# EAGLE design photon_v1.0.0 (EAGLE 7.2.0)

## Sheet 1 of 2
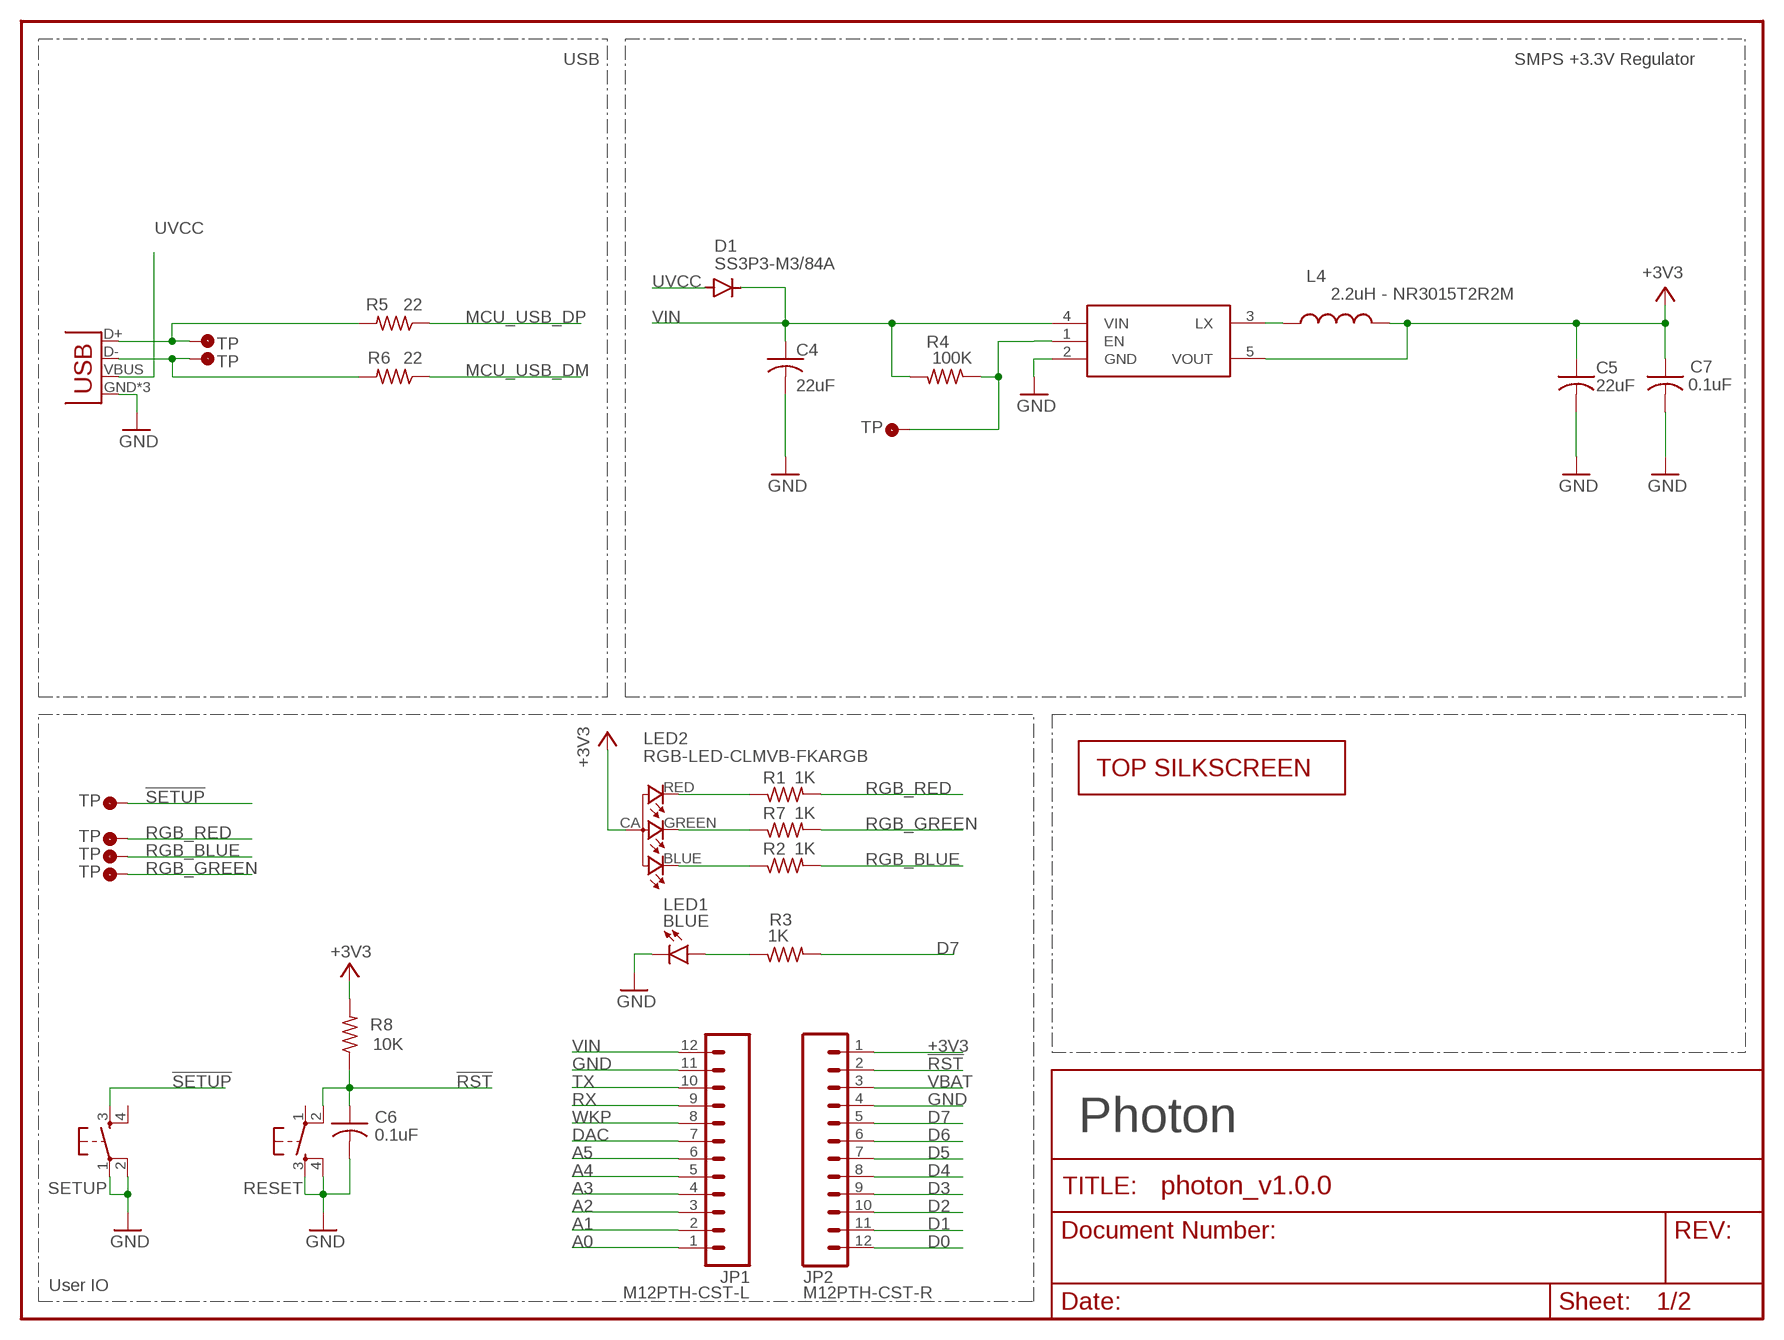
[diagram p0: schematic, sheet 1]

### Parts
C4  22uF  C-US0603  [C0603_B]
C5  22uF  C-US0603  [C0603_B]
C6  0.1uF  C-US  [C0402_B]
C7  0.1uF  C-US  [C0402_B]
D1  SS3P3-M3/84A  DIODE  [DIODE-DO-220AA(SMP)]
JP1  M12PTH-CST-L  [1X12-CASTELLATED]
JP2  M12PTH-CST-R  [1X12-CASTELLATED]
L4  2.2uH - NR3015T2R2M  INDUCTORB  [INDUCTOR-NR3015]
LED2  RGB-LED-CLMVB-FKARGB  [PLCC4-2MM-RGB]
LED_USR  BLUE  LED-0603-NO-SS  [LED-0603-NO-SS]
R1  1K  R-US_  [R0402_B]
R2  1K  R-US_  [R0402_B]
R3  1K  R-US_  [R0402_B]
R4  100K  R-US_  [R0402_B]
R5  22  R-US_  [R0402_B]
R6  22  R-US_  [R0402_B]
R7  1K  R-US_  [R0402_B]
R8  10K  R-US_  [R0402_B]
RESET  KMR211GLFS  TAC_SWITCHSMD  [TACTILE_SWITCH_SMD]
SETUP  KMR211GLFS  TAC_SWITCHSMD  [TACTILE_SWITCH_SMD]
U$1  PHOTON-TOP-SS2  [PHOTON-TOP-SS-2]
U$3  TP3  [TP60_BOT]
U$5  TP1  [TP35_BOT]
U$6  TP1  [TP35_BOT]
U$7  TP1  [TP35_BOT]
U$11  R8008-33  [SOT23-5]
U$12  TP3  [TP60_BOT]
U$13  TP3  [TP60_BOT]
U$14  TP3  [TP60_BOT]
X1  USB-MICROB  USBUSB-MICROB-SLOT-HOLE  [USB-MICROB-SLOT-HOLE]

### Nets
!RST: C6.1 JP2.2 R8.1 RESET.2 ; also sheet 2
!SETUP: SETUP.3 U$3.P$1(TP) ; also sheet 2
+3V3: C5.1 C7.1 JP2.1 L4.2 LED2.CA R8.2 U$11.5(VOUT) ; also sheet 2
A0: JP1.1 ; also sheet 2
A1: JP1.2 ; also sheet 2
A2: JP1.3 ; also sheet 2
A3: JP1.4 ; also sheet 2
A4: JP1.5 ; also sheet 2
A5: JP1.6 ; also sheet 2
D0: JP2.12 ; also sheet 2
D1: JP2.11 ; also sheet 2
D2: JP2.10 ; also sheet 2
D3: JP2.9 ; also sheet 2
D4: JP2.8 ; also sheet 2
D5: JP2.7 ; also sheet 2
D6: JP2.6 ; also sheet 2
D7: JP2.5 R3.2 ; also sheet 2
DAC: JP1.7 ; also sheet 2
GND: C4.2 C5.2 C6.2 C7.2 JP1.11 JP2.4 LED_USR.C1(C) RESET.3 RESET.4 SETUP.1 SETUP.2 U$11.2(GND) X1.GND X1.MT1(GND) X1.MT2(GND) ; also sheet 2
LED1: LED_USR.A1(A) R3.1
MCU_USB_DM: R6.1 ; also sheet 2
MCU_USB_DP: R5.1 ; also sheet 2
N$1: R5.2 U$13.P$1(TP) X1.D+
N$3: L4.1 U$11.3(LX)
N$6: R6.2 U$14.P$1(TP) X1.D-
N$7 [vcc]: R4.1 U$11.1(EN) U$12.P$1(TP)
N$27: LED2.BLUE R2.1
N$29: LED2.GREEN R7.1
N$54: LED2.RED R1.1
RGB_BLUE: R2.2 U$6.P$1(TP) ; also sheet 2
RGB_GREEN [vcc]: R7.2 U$7.P$1(TP) ; also sheet 2
RGB_RED: R1.2 U$5.P$1(TP) ; also sheet 2
RX: JP1.9 ; also sheet 2
TX: JP1.10 ; also sheet 2
UVCC: D1.ANODE X1.VBUS
VBAT: JP2.3 ; also sheet 2
VIN [vcc]: C4.1 D1.CATHODE JP1.12 R4.2 U$11.4(VIN)
WKP: JP1.8 ; also sheet 2
Unconnected: RESET.1 SETUP.4

### Notes on the sheet
- USB | SMPS +3.3V Regulator
- Photon
- User IO

## Sheet 2 of 2
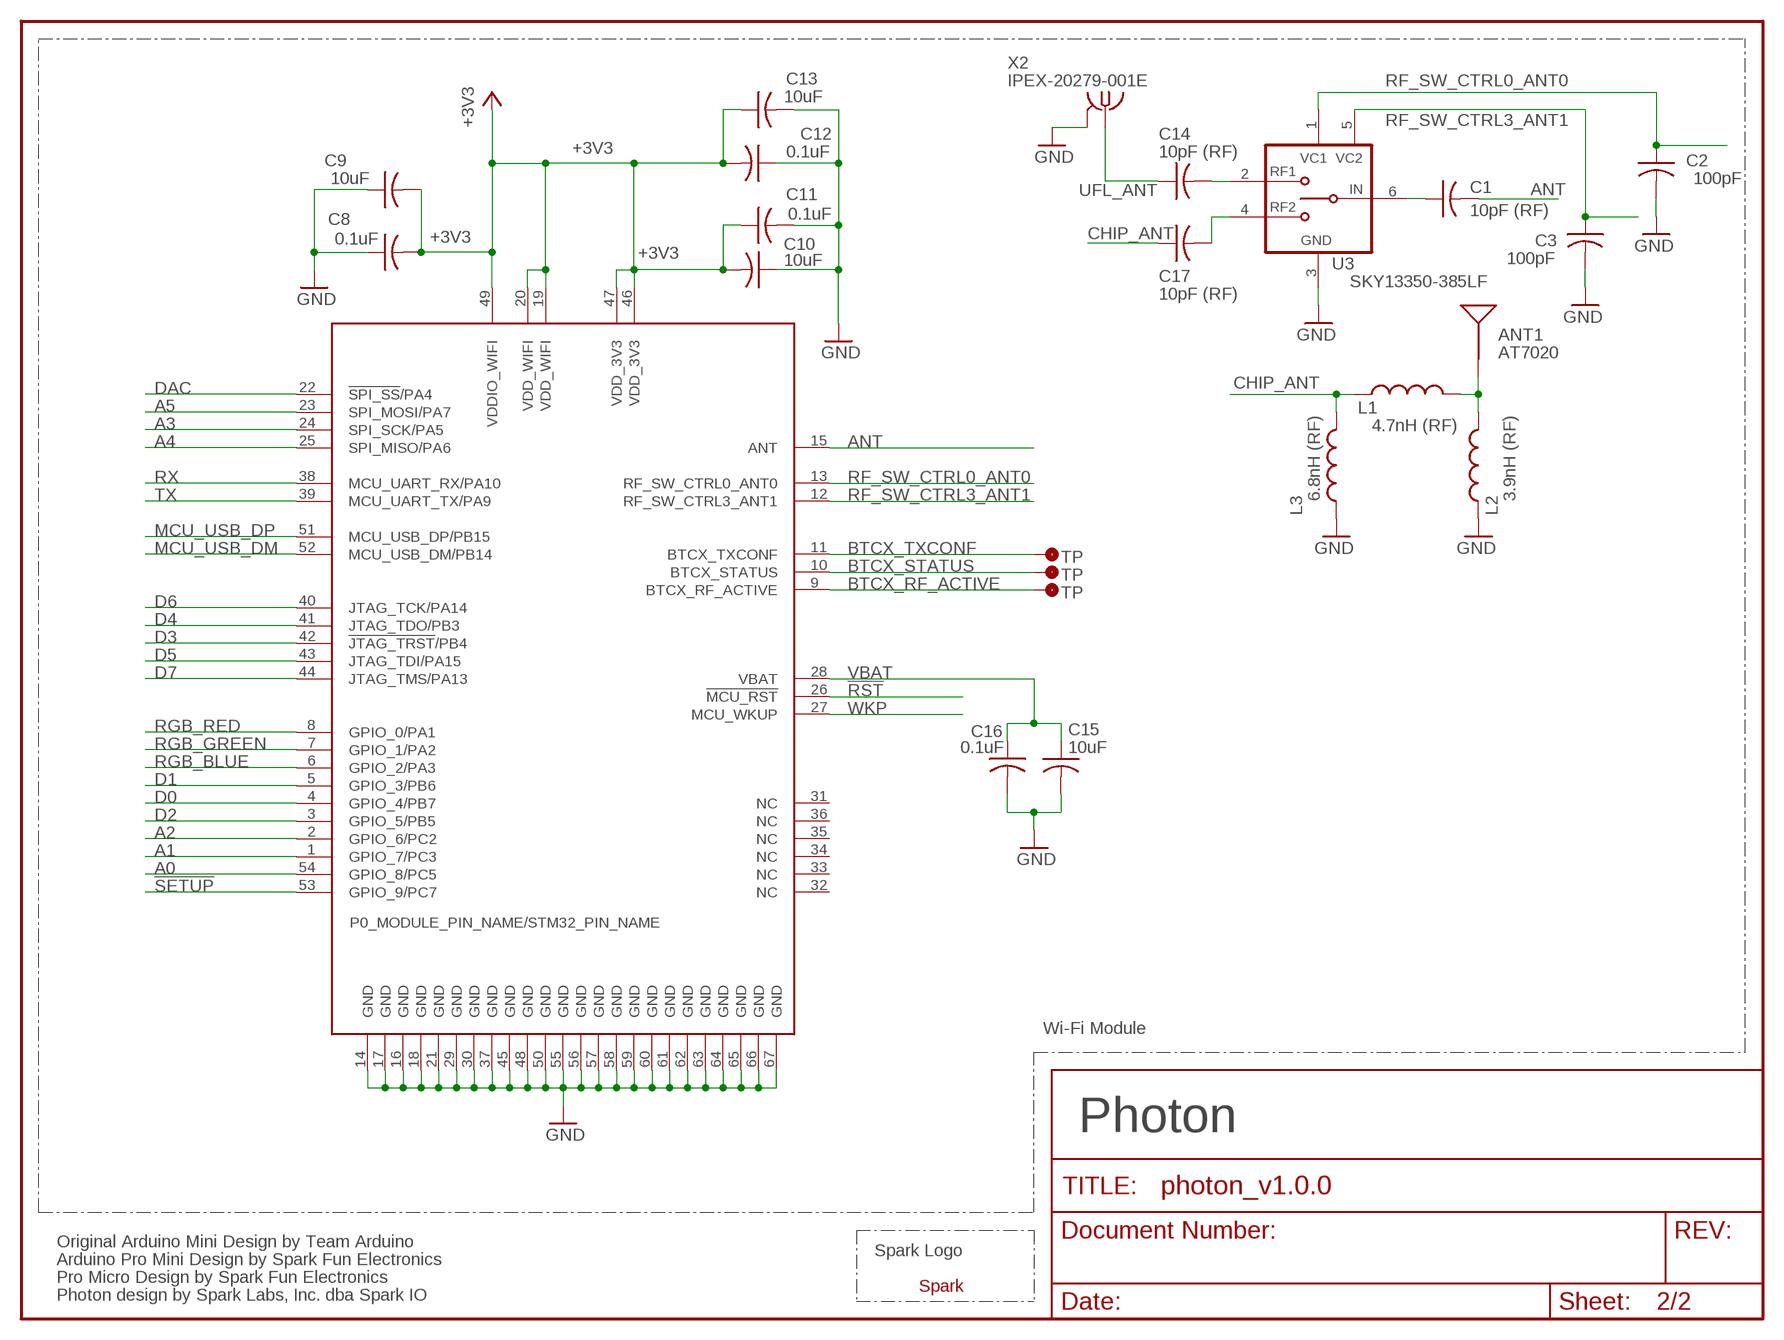
[diagram p1: schematic, sheet 2]

### Parts
ANT1  AT7020  [AT7020]
C1  10pF (RF)  C-US0201  [C0201_B]
C2  100pF  C-US  [C0402_B]
C3  100pF  C-US  [C0402_B]
C8  0.1uF  C-US  [C0402_B]
C9  10uF  C-US0603  [C0603_B]
C10  10uF  C-US0603  [C0603_B]
C11  0.1uF  C-US  [C0402_B]
C12  0.1uF  C-US  [C0402_B]
C13  10uF  C-US0603  [C0603_B]
C14  10pF (RF)  C-US0201  [C0201_B]
C15  10uF  C-US0603  [C0603_B]
C16  0.1uF  C-US  [C0402_B]
C17  10pF (RF)  C-US0201  [C0201_B]
L1  4.7nH (RF)  INDUCTOR  [L0402_B]
L2  3.9nH (RF)  INDUCTOR  [L0402_B]
L3  6.8nH (RF)  INDUCTOR  [L0402_B]
U1  WM-N-BM-09  [WM-N-BM-09]
U3  SKY13350-385LF  [XFDFN-6]
U$2  SPARK_LOGO2  [SPARK_LOGO2]
U$8  TP1  [TP35_BOT]
U$9  TP1  [TP35_BOT]
U$10  TP1  [TP35_BOT]
X2  IPEX-20279-001E  [IPEX-20279-001E]

### Nets
!RST: U1.26(!MCU_RST) ; also sheet 1
!SETUP: U1.53(GPIO_9/PC7) ; also sheet 1
+3V3: C8.2 C9.2 C10.2 C11.1 C12.2 C13.1 U1.19(VDD_WIFI) U1.20(VDD_WIFI) U1.46(VDD_3V3) U1.47(VDD_3V3) U1.49(VDDIO_WIFI) ; also sheet 1
A0: U1.54(GPIO_8/PC5) ; also sheet 1
A1: U1.1(GPIO_7/PC3) ; also sheet 1
A2: U1.2(GPIO_6/PC2) ; also sheet 1
A3: U1.24(SPI_SCK/PA5) ; also sheet 1
A4: U1.25(SPI_MISO/PA6) ; also sheet 1
A5: U1.23(SPI_MOSI/PA7) ; also sheet 1
ANT [RF]: C1.2 U1.15(ANT)
BTCX_RF_ACTIVE: U1.9(BTCX_RF_ACTIVE) U$10.P$1(TP)
BTCX_STATUS: U1.10(BTCX_STATUS) U$9.P$1(TP)
BTCX_TXCONF: U1.11(BTCX_TXCONF) U$8.P$1(TP)
CHIP_ANT [RF]: C17.1 L1.1 L3.2
D0: U1.4(GPIO_4/PB7) ; also sheet 1
D1: U1.5(GPIO_3/PB6) ; also sheet 1
D2: U1.3(GPIO_5/PB5) ; also sheet 1
D3: U1.42(!JTAG_TRST!/PB4) ; also sheet 1
D4: U1.41(JTAG_TDO/PB3) ; also sheet 1
D5: U1.43(JTAG_TDI/PA15) ; also sheet 1
D6: U1.40(JTAG_TCK/PA14) ; also sheet 1
D7: U1.44(JTAG_TMS/PA13) ; also sheet 1
DAC: U1.22(!SPI_SS!/PA4) ; also sheet 1
GND: C2.2 C3.2 C8.1 C9.1 C10.1 C11.2 C12.1 C13.2 C15.2 C16.2 L2.1 L3.1 U1.14(GND) U1.16(GND) U1.17(GND) U1.18(GND) U1.21(GND) U1.29(GND) U1.30(GND) U1.37(GND) U1.45(GND) U1.48(GND) U1.50(GND) U1.55(GND) U1.56(GND) U1.57(GND) U1.58(GND) U1.59(GND) U1.60(GND) U1.61(GND) U1.62(GND) U1.63(GND) U1.64(GND) U1.65(GND) U1.66(GND) U1.67(GND) U3.3(GND) X2.2@1(GND) X2.2@2(GND) ; also sheet 1
MCU_USB_DM: U1.52(MCU_USB_DM/PB14) ; also sheet 1
MCU_USB_DP: U1.51(MCU_USB_DP/PB15) ; also sheet 1
N$2 [RF]: ANT1.1(SIGNAL) L1.2 L2.2
N$9: C1.1 U3.6(IN)
N$10: C14.2 U3.2(RF1)
N$11: C17.2 U3.4(RF2)
RF_SW_CTRL0_ANT0: C2.1 U1.13(RF_SW_CTRL0_ANT0) U3.1(VC1)
RF_SW_CTRL3_ANT1: C3.1 U1.12(RF_SW_CTRL3_ANT1) U3.5(VC2)
RGB_BLUE: U1.6(GPIO_2/PA3) ; also sheet 1
RGB_GREEN [vcc]: U1.7(GPIO_1/PA2) ; also sheet 1
RGB_RED: U1.8(GPIO_0/PA1) ; also sheet 1
RX: U1.38(MCU_UART_RX/PA10) ; also sheet 1
TX: U1.39(MCU_UART_TX/PA9) ; also sheet 1
UFL_ANT [RF]: C14.1 X2.1
VBAT: C15.1 C16.1 U1.28(VBAT) ; also sheet 1
WKP: U1.27(MCU_WKUP) ; also sheet 1
Unconnected: U1.31(NC) U1.32(NC) U1.33(NC) U1.34(NC) U1.35(NC) U1.36(NC)

### Notes on the sheet
- Wi-Fi Module
- Photon
- Original Arduino Mini Design by Team Arduino
- Spark Logo
- Arduino Pro Mini Design by Spark Fun Electronics
- Pro Micro Design by Spark Fun Electronics
- Photon design by Spark Labs, Inc. dba Spark IO

## Library data of the parts
ANT1 = Spark:AT7020
C1 C4 C5 C9 C10 C13-C15 C17 = Bretts-Spark-Library:C-US: Capacitor
C2 C3 C6-C8 C11 C12 C16 = Spark:C-US: Capacitor
D1 = Spark:DIODE
JP1 JP2 = Spark:M12: Header 12 Standard 12-pin 0.1" header. Use with straight break away headers (SKU : PRT-00116), right angle break away headers (PRT-00553), swiss pins (PRT-00743), machine pins (PRT-00117), and female headers (PRT-00115).
L1-L4 = Spark:INDUCTOR
LED2 = Spark:RGB-LED-CLMVB-FKA: CREE CLMVB-FKA RGB LED 2mm x 2mm
LED_USR = Bretts-Spark-Library:LED
R1-R8 = Spark:R-US_: 0402 Resistor
RESET SETUP = Spark:TAC_SWITCH: SMD Tactiile Switch
U1 = Spark:WM-N-BM-09
U3 = Spark:SKY13350-385LF
U$1 = Spark:PHOTON-TOP-SS
U$2 = Spark:SPARK_LOGO2
U$3 U$5-U$10 U$12-U$14 = Spark:TP: Test Points of all sizes and shapes
U$11 = Spark:R8008-33
X1 = Spark:USB
X2 = Spark:IPEX-20279-001E: Ultra Miniature Coaxial SMT RF Receptacle

## Net classes
2 RF: width 0.33 mm, clearance 0.191 mm

## Board
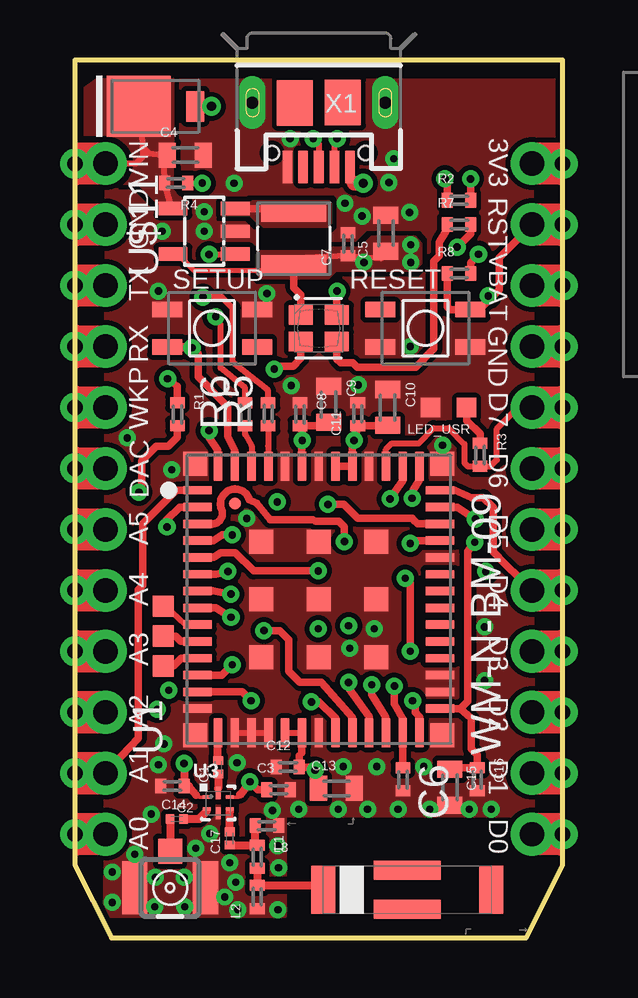
[diagram p2: board, top side]
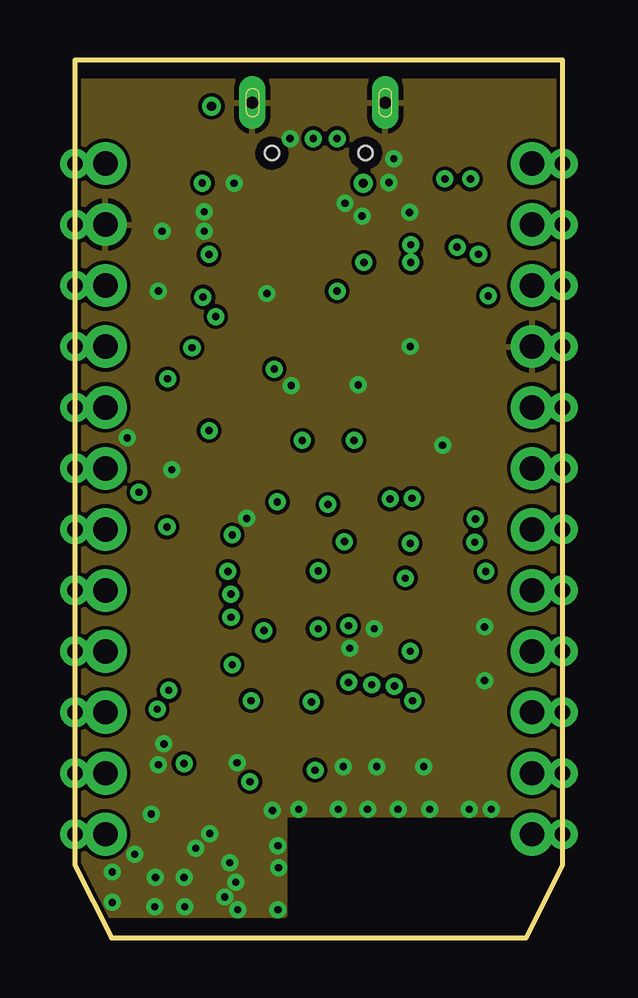
[diagram p3: board, inner layer $GND]
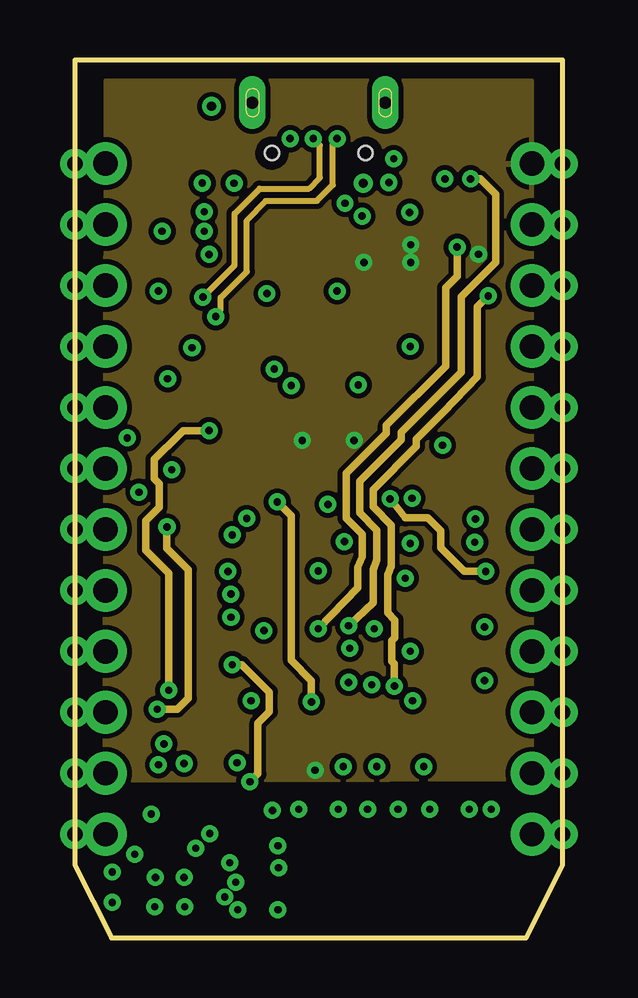
[diagram p4: board, inner layer $+3V3]
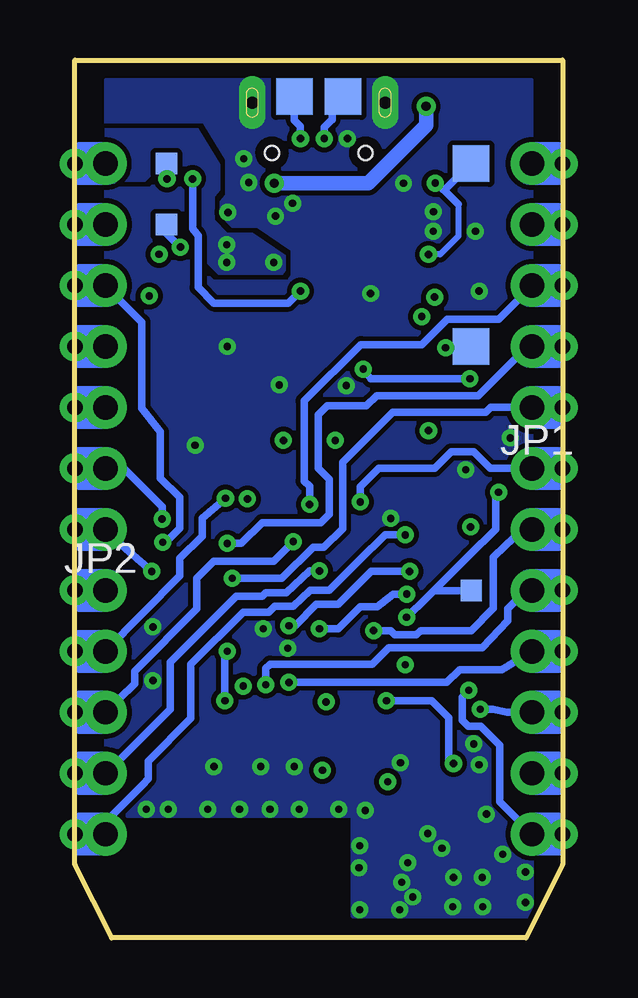
[diagram p5: board, bottom side, seen from below]

Size 20.32 x 36.58 mm. Coordinates in mm from the lower left corner, seen from the top.
Outline: 0,36.58 0,3.05 1.52,0 18.8,0 20.32,3.05 20.32,36.58 0,36.58
Copper layers (1+2*15+16): Top 0.018mm / dielectric 0.195mm / $GND 0.035mm / dielectric 1.1mm / $+3V3 0.035mm / dielectric 0.195mm / Bottom 0.018mm
Design rules "spark": minimum track width 6mil, minimum drill 0.3mm, track to track 6mil, track to pad 6mil, pad to pad 6mil, via to via 6mil, smd to smd 6mil, copper to edge 6mil, drill to drill 6mil, minimum pad ring 12mil, minimum via ring 8mil, stop-mask expansion 4mil, vias tented up to drill 20mil, thermal gap 8mil
tRestrict: area 7.8,28.8 to 10.5,29.5

### Footprints (pad centres in the part's own frame; a part is rotated, then mirrored left to right if it is on the bottom)
AT7020 = smd 1 x 2: 1 3.5,0; 3 -3.5,0 | smd 2.8 x 0.8: 2 0,0.815; 4 0,-0.815
C0201_B = smd 0.356 x 0.406: 1 -0.279,0; 2 0.279,0
C0402_B = smd 0.457 x 0.61: 1 -0.483,0; 2 0.483,0
C0603_B = smd 0.711 x 1.041: 1 -0.749,0; 2 0.749,0
DIODE-DO-220AA(SMP) = smd 0.762 x 1.27: ANODE 2.349,0 | smd 2.667 x 2.54: CATHODE 0,0
1X12-CASTELLATED = drill 1.016 pad 1.778: 1 0,-13.97; 2 0,-11.43; 3 0,-8.89; 4 0,-6.35; 5 0,-3.81; 6 0,-1.27; 7 0,1.27; 8 0,3.81; 9 0,6.35; 10 0,8.89; 11 0,11.43; 12 0,13.97 | drill 0.635 pad 1.016: @1 1.27,-13.97; @2 1.27,-11.43; @3 1.27,-8.89; @4 1.27,-6.35; @5 1.27,-3.81; @6 1.27,-1.27; @7 1.27,1.27; @8 1.27,3.81; @9 1.27,6.35; @10 1.27,8.89; @11 1.27,11.43; @12 1.27,13.97
L0402_B = smd 0.457 x 0.61: 1 -0.483,0; 2 0.483,0
INDUCTOR-NR3015 = smd 0.8 x 2.7: 1 -1.1,0; 2 1.1,0
PLCC4-2MM-RGB = smd 1 x 0.8: BLUE -0.75,-0.55; CA 0.75,-0.55; GREEN -0.75,0.55; RED 0.75,0.55
LED-0603-NO-SS = smd 0.8 x 0.8: A1 0,-0.745; C1 0,0.755
R0402_B = smd 0.457 x 0.61: 1 -0.483,0; 2 0.483,0
TACTILE_SWITCH_SMD = smd 1.25 x 0.65: 1 -1.875,0.775; 2 1.875,0.775; 3 -1.875,-0.775; 4 1.875,-0.775
WM-N-BM-09 = smd 0.35 x 1.2: 1 4.55,5.05; 2 3.85,5.05; 3 3.15,5.05; 4 2.45,5.05; 5 1.75,5.05; 6 1.05,5.05; 7 0.35,5.05; 8 -0.35,5.05; 9 -1.05,5.05; 10 -1.75,5.05; 11 -2.45,5.05; 12 -3.15,5.05; 13 -3.85,5.05; 14 -4.55,5.05; 28 -4.55,-5.05; 29 -3.85,-5.05; 30 -3.15,-5.05; 31 -2.45,-5.05; 32 -1.75,-5.05; 33 -1.05,-5.05; 34 -0.35,-5.05; 35 0.35,-5.05; 36 1.05,-5.05; 37 1.75,-5.05; 38 2.45,-5.05; 39 3.15,-5.05; 40 3.85,-5.05; 41 4.55,-5.05 | smd 1.2 x 0.35: 15 -5.55,4.2; 16 -5.55,3.5; 17 -5.55,2.8; 18 -5.55,2.1; 19 -5.55,1.4; 20 -5.55,0.7; 21 -5.55,0; 22 -5.55,-0.7; 23 -5.55,-1.4; 24 -5.55,-2.1; 25 -5.55,-2.8; 26 -5.55,-3.5; 27 -5.55,-4.2; 42 5.55,-4.2; 43 5.55,-3.5; 44 5.55,-2.8; 45 5.55,-2.1; 46 5.55,-1.4; 47 5.55,-0.7; 48 5.55,0; 49 5.55,0.7; 50 5.55,1.4; 51 5.55,2.1; 52 5.55,2.8; 53 5.55,3.5; 54 5.55,4.2 | smd 1 x 1: 55 5.65,5.15; 56 -5.65,5.15; 57 -5.65,-5.15; 58 5.65,-5.15; 59 2.4,2.4; 60 0,2.4; 61 -2.4,2.4; 62 2.4,0; 63 0,0; 64 -2.4,0; 65 2.4,-2.4; 66 0,-2.4; 67 -2.4,-2.4 | smd 0.5 x 0.5: 68 4,3.5
XFDFN-6 = smd 0.33 x 0.15: 1 -0.485,0.25; 2 -0.485,-0.25; 4 0.485,-0.25; 5 0.485,0.25 | smd 0.2 x 0.51: 3 0,-0.42; 6 0,0.42
TP60_BOT = smd 1.524 x 1.524 bottom: P$1 0,0
TP35_BOT = smd 0.889 x 0.889 bottom: P$1 0,0
SOT23-5 = smd 0.55 x 1.2: 1 -0.95,-1.3; 2 0,-1.3; 3 0.95,-1.3; 4 0.95,1.3; 5 -0.95,1.3
USB-MICROB-SLOT-HOLE = smd 0.4 x 1.35: D+ 0,2.675; D- -0.65,2.675; GND 1.3,2.675; ID 0.65,2.675; VBUS -1.3,2.675 | drill 0.5 pad 1.1 long: MT1 -2.775,0; MT2 2.775,0 | smd 1.5 x 1.9: P$1 -1,0; P$2 1,0.01 | hole 0.6: -1.95,2.1; 1.95,2.1
IPEX-20279-001E = smd 1 x 1.05: 1 0,1.528 | smd 1.05 x 2.2: 2@1 -1.475,0; 2@2 1.475,0

### Placement (x,y rotation side)
ANT1  13.84,2.01 180 top
C1  5.97,7.11 90 top
C2  4.06,6.32 180 top
C3  8.48,6.17 0 top
C4  4.6,32.61 0 top
C5  12.95,29.36 90 top
C6  13.67,6.6 270 top
C7  11.38,28.91 90 top
C8  9.37,21.82 270 top
C9  10.57,22.23 270 top
C10  13.03,22.1 270 top
C11  11.79,21.82 90 top
C12  8.86,7.11 0 top
C13  10.9,6.22 0 top
C14  4.24,4.95 0 top
C15  15.62,6.27 270 top
C16  16.76,6.6 270 top
C17  6.45,4.14 90 top
D1  2.67,34.65 0 top
JP1  1.27,18.29 0 bottom
JP2  19.05,18.29 180 bottom
L1  7.59,3.38 270 top
L2  7.59,1.7 90 top
L3  8,4.67 180 top
L4  9.12,29.13 270 top
LED2  10.16,25.4 180 top
LED_USR  15.57,22.1 90 top
R1  4.27,21.82 270 top
R2  16,30.73 0 top
R3  16.88,20.13 270 top
R4  4.22,31.45 180 top
R5  8.05,21.82 90 top
R6  7.09,21.82 90 top
R7  16,29.72 0 top
R8  16,27.69 0 top
RESET  14.61,25.4 0 top
SETUP  5.71,25.4 0 top
U1  10.16,14.1 90 top
U3  5.97,5.61 0 top
U$1  0,0.51 0 top
U$2  16.51,33.35 0 top
U$3  3.81,24.64 0 top
U$5  3.81,14.48 0 top
U$6  16.51,32.26 0 top
U$7  16.51,29.72 0 top
U$8  3.68,11.33 0 bottom
U$9  3.68,12.57 0 bottom
U$10  3.68,13.82 0 bottom
U$11  5.38,29.44 90 top
U$12  3.81,32.26 0 top
U$13  9.14,35.05 0 top
U$14  11.18,35.05 0 top
X1  10.16,34.8 180 top
X2  3.96,2.08 0 top

### Tracks (layer width: path | path; a pad name or v marks a point on that pad's centre or on a via)
!RST  (via drill 0.3)
  Top 0.254: U1.26
  Top 0.305: JP2.2 17.68,28.35 17.68,27 17.29,26.61 | U1.26 13.66,9.12 13.31,9.75 v13.31,10.49 | C6.1 U1.26 | 16.84,26.16 RESET.2 | v17.22,26.75 17.35,26.72 17.29,26.61 | 17.29,26.61 16.84,26.16 | 16.84,26.16 RESET.2 | R8.1 15.52,26.29 15.63,26.18 RESET.2
  $+3V3 0.305: v13.31,10.49 13.31,11.43 13.21,11.53 13.21,12.37 13.34,12.5 13.34,13.23 13.03,13.54 13.03,15.11 13.18,15.49 13.18,17.2 12.42,17.96 12.42,18.67 14.22,20.47 14.22,20.78 15.34,21.89 16.76,23.37 16.76,26.29 v17.22,26.75
!SETUP  (via drill 0.3)
  Top 0.254: U1.53 6.66,20.29
  Top 0.305: 6.66,20.29 6.38,20.9 6.38,22.12 6.26,22.24 5.13,23.37 5.13,24.33 v4.88,24.59 | v4.88,24.59 4.84,24.62 SETUP.3 3.88,24.59 v4.88,24.59
  Bottom 0.305: U$3.P$1 4.83,24.64 v4.88,24.59
+3V3  (via drill 0.3)
  Top 0: 9.14,28.31 L4.2 | 12.75,28.31 C5.1
  Top 0.203: U$11.5 4.33,28.44 4.95,27.81 7.85,27.81 8.07,28.03 L4.2
  Top 0.254: U1.19 U1.20 | 9.14,28.31 C7.1 12.75,28.31
  Top 0.305: C13.1 10.13,6.86 v10.01,6.99 9.88,7.11 C12.2 9.35,7.59 9.46,7.71 U1.20 | C9.2 10.13,21.34 9.46,21.34 | C11.1 13.01,21.34 C10.2 | U1.49 9.46,21.34 | 9.46,21.34 C8.2 | U1.47 U1.46 11.56,20.62 11.56,20.78 C11.1 | v11.63,20.73 C11.1 | 9.46,21.34 9.47,21.32 v9.47,20.73 | L4.2 9.12,27.08 9.41,26.79 LED2.CA | v16.81,28.48 16.48,28.12 R8.2
  other vias: 14,28.14 14,28.88 12.04,28.14
  pour $+3V3 (isolate 0.203, rank 2): 1.27,35.74 19.05,35.74 19.05,6.58 1.22,6.53
  pour Top (no thermals): 7.7,28.6 7.54,28.47 7.54,27.66 7.75,27.43 10.57,27.43 10.9,27.76 14.15,27.76 14.48,28.09 14.48,28.93 14.2,29.26 12.34,29.26 11.89,28.8 10.72,28.8 10.54,28.65 7.75,28.65
  pour Bottom (isolate 0.203, no thermals): 11.53,28.45 11.53,27.79 11.66,27.64 14.35,27.64 14.88,28.17 14.88,29.49 15.09,29.72 15.09,31.19 14.88,31.39 14.88,31.85 15.19,32.16 17.12,32.16 17.12,31.78 17.4,31.5 19.08,31.5 19.08,33.73 15.19,33.73 14.27,32.23 14.27,31.14 14.5,30.89 14.5,29.92 13.97,29.39 12.9,29.39
A0  (via drill 0.3)
  Top 0.305: v5.59,21.13 5.59,20.83 5.94,20.32 U1.54
  $+3V3 0.305: v3.91,10.31 3.91,15.19 2.95,16.15 2.95,17.37 3.5,17.93 3.5,18.92 3.3,19.13 3.3,19.94 4.34,20.95 4.52,21.13 v5.59,21.13
  Bottom 0.305: v3.91,10.31 4.19,10.03 4.19,9.07 3.94,8.81 3.4,8.81 2.62,8.03 2.62,5.66 JP1.1
A1
  Top 0.305: JP1.2 2.64,8.31 2.64,14.5 2.82,14.68 2.82,17.25 4.22,18.65 U1.1
A2  (via drill 0.3)
  Top 0.305: v3.83,17.12 3.83,17.42 4.36,17.95 U1.2
  $+3V3 0.305: v3.43,9.53 4.27,9.53 4.72,9.98 4.72,15.34 3.83,16.23 v3.83,17.12
  Bottom 0.305: v3.43,9.53 2.92,9.53 2.31,9.4 JP1.3
A3  (via drill 0.3)
  Top 0.305: U1.24 12.26,9.2 11.4,10.39 v11.4,10.64
  Bottom 0.305: JP1.4 2.54,11.18 4.29,11.18 4.83,10.64 v11.4,10.64
A4  (via drill 0.3)
  Top 0.305: U1.25 12.96,9.01 12.95,9.17 12.95,9.2 12.72,9.58 12.37,10.13 v12.37,10.54
  Bottom 0.305: v12.37,10.54 12.37,11.23 12.19,11.4 7.92,11.4 7.24,12.09 3.35,12.09 2.29,13.21 2.29,13.72 1.52,14.48 JP1.5
A5  (via drill 0.3)
  Top 0.305: v7.87,12.8 8.53,12.8 8.91,12.42 8.91,11.1 9.37,10.64 10.26,10.64 11.56,9.19 U1.23
  Bottom 0.305: v7.87,12.8 7.16,12.8 6.99,12.62 6.1,12.62 5.92,12.8 3.81,12.8 2.9,13.74 2.9,15.85 2.41,16.31 1.65,17.02 JP1.6
ANT
  Top 0.305: C1.2 5.96,7.48
  Top 0.33: 5.96,7.48 U1.15
BTCX_RF_ACTIVE
  Top 0.254: 3.76,13.82 4.61,13.05 U1.9
  Top 0.305: U$10.P$1 3.76,13.82
BTCX_STATUS
  Top 0.305: U$9.P$1 4.19,12.57 4.42,12.35 U1.10
BTCX_TXCONF
  Top 0.305: U$8.P$1 4.12,11.33 4.43,11.65 U1.11
CHIP_ANT
  Top 0.33: L3.2 7.52,3.89 arc90 L1.1 C17.1
D0  (via drill 0.3)
  Top 0.305: U1.4 5.73,16.55 5.75,16.55 6.15,16.79 v6.55,16.79
  Bottom 0.305: v6.55,16.79 7.39,16.79 8.51,15.7 9.73,14.48 10.52,14.48 11.23,13.82 11.99,13.82 12.24,13.56 13.31,13.56 15.49,11.4 15.49,9.14 17.27,7.37 17.27,6.63 17.5,6.38 19.05,4.83 JP2.12
D1  (via drill 0.3)
  Top 0.305: v10.13,15.29 7.44,15.29 6.68,16.05 6.07,16.05 5.79,15.85 U1.5
  Bottom 0.305: v10.13,15.29 10.54,15.29 11.51,14.38 12.37,14.38 12.52,14.22 13.59,14.22 16.36,11.48 16.36,9.53 19.02,6.86 JP2.11
D2  (via drill 0.3)
  Top 0.305: v11.23,16.51 11.23,17.12 11,17.35 10.03,17.35 9.91,17.42 8.13,17.42 7.57,18.11 7.26,18.26 arc189 6.12,17.83 arc-118 5.64,17.25 U1.3 | U1.3
  Bottom 0.305: v11.23,16.51 12.04,15.7 14.53,15.7 15.24,14.99 15.24,13.72 17.83,11.1 17.83,10.59 JP2.10
D3  (via drill 0.3)
  Top 0.305: 14.33,19.61 U1.42 14.35,19.11 14.33,19.02 14.1,18.67 v14.05,18.31
  Bottom 0.305: v14.05,18.31 15.01,17.48 15.01,16.74 15.95,15.82 15.95,15.09 JP2.9
D4
  Top 0.305: U1.41 15.82,18.65 16.54,18.34 17.02,18.34 17.42,17.93 17.42,16.08 17.96,15.54 JP2.8
D5  (via drill 0.3)
  Top 0.305: U1.43 13.66,19.06 13.66,19.05 13.21,18.39 v13.13,18.29
  $+3V3 0.305: v13.13,18.29 13.77,17.5 14.71,17.5 15.24,16.97 15.24,16.26 16.23,15.27 v17.12,15.27
  Bottom 0.305: JP2.7 18.92,16.84 18.74,16.69 18.51,16.48 v17.12,15.27
D6  (via drill 0.3)
  Top 0.305: U1.40 15.94,17.95 v16.69,17.45
  Bottom 0.305: v16.69,17.45 16.69,17.96 18.29,19.56 JP2.6
D7
  Top 0.254: JP2.5 18.36,22.43 18.36,22 17.58,21.21 17.58,19.91 17.31,19.65 R3.2 16.37,19.65 16.23,19.79 16.23,20.57 15.57,21.23 14.94,21.23 14.33,20.6 13.21,20.6 12.96,20.35 U1.44
DAC  (via drill 0.3)
  Top 0.305: U1.22 10.86,9.15 10.16,9.83 v9.86,9.83
  $+3V3 0.305: v9.86,9.83 9.86,10.72 9.02,11.56 9.02,17.58 v8.43,18.16
  Bottom 0.305: v8.43,18.16 8.43,18.8 7.67,19.56 5.33,19.56 4.65,20.24 3.71,20.24 3.02,19.56 JP1.7
GND  (via drill 0.3)
  Top 0.254: U1.16 U1.17 U1.18 | 8.94,6.17 8.94,6.07 C3.2
  other vias: 2.49,3.48 1.55,1.47 8.46,1.17 6.25,1.7 14.53,7.14 4.55,2.51 1.55,2.74 9.32,5.36 16.43,5.36 13.46,5.36 10.97,5.36 12.19,5.36 3.71,8.08 11.25,30.61 5.38,29.44 5.38,30.25 3.63,29.44 8.97,33.3 13.28,32.46 13.94,30.23 15.32,20.52 4.04,19.51 11.46,12.06 12.47,12.88 3.48,26.95 17.07,10.72 9.02,23.01 17.35,5.36 3.48,7.21 14.78,5.36 3.35,2.51 11.81,23.04 8,26.85 13.97,24.64 6.63,31.45 13.08,31.47 11.18,7.14 7.16,17.48 2.18,20.83 17.07,12.95 11.96,30.07 8.46,3.84 4.57,1.3 6.78,1.17 3.33,1.3 5.03,3.73 6.71,2.31 12.57,7.14 8.48,2.92 5.61,4.34 6.45,3.12 3.17,5.16 8.23,5.31 6.76,7.29
  pour Top (isolate 0.203, rank 3, no thermals): 1.3,35.74 20.35,35.74 20.35,33.27 19.05,33.27 19.1,5.08 8.76,5.08 8.76,0.89 1.24,0.89 1.27,4.32 1.27,5.59
  pour $GND: 0,35.71 20.32,35.71 20.32,5.11 8.74,5.11 8.74,0.91 1.17,0.91 0.13,3.05 0.13,3.56
  pour Bottom (isolate 0.203, rank 2, no thermals): 1.3,35.71 19.02,35.71 19.02,5.11 8.74,5.11 8.74,0.91 1.28,0.91
  pour Top (no thermals): 6.38,29.67 5.56,29.67 5.56,29.11 6.4,29.11 6.38,29.13
LED1
  Top 0.305: LED_USR.A1 16.32,21.55 16.88,20.99 R3.1
MCU_USB_DM
  Top 0.254: U1.52 7.36,20.5 7.09,20.98 R6.1
MCU_USB_DP
  Top 0.254: U1.51 8.05,20.49 R5.1
N$1  (via drill 0.3)
  Top 0.254: R5.2 8.05,22.81 6.58,23.98 6.58,26.24 6.12,26.7 v5.33,26.7 | v9.93,33.3 10.16,33.07 X1.D+
  $+3V3 0.254: v5.33,26.7 6.66,28.02 6.66,30.18 7.7,31.22 9.75,31.22 10.21,31.67 10.21,33.02 v9.93,33.3
  Bottom 0.305: v9.93,33.3 9.93,33.78 9.65,34.04 9.6,34.09 9.6,34.54 U$13.P$1
N$2
  Top 0.33: ANT1.1 10.16,2.18 L2.2 L1.2
N$3
  Top 0.305: U$11.3 6.68,30.38 8,30.38 8,30.49 L4.1
  pour Top (no thermals): 6.1,30.66 7.29,30.66 7.39,30.73 10.59,30.73 10.69,30.63 10.69,29.74 10.54,29.59 7.85,29.59 7.72,29.72 7.65,29.72 7.29,30.07 6.1,30.07
N$4
  cutout $GND: 7.52,32.7 arc-90 8.21,33.39 8.22,33.39 arc-91 8.9,32.7 arc-88 8.21,32.01 arc-92
N$6  (via drill 0.3)
  Top 0.254: R6.2 7.09,22.91 6.07,23.75 6.07,25.55 v5.87,25.88 | 10.82,32.13 X1.D- 10.81,33.19 v10.92,33.3
  $+3V3 0.254: v5.87,25.88 6.07,26.16 6.07,26.67 7.16,27.76 7.16,29.9 7.95,30.71 10.08,30.71 10.74,31.37 10.74,33.1 v10.92,33.3
  Bottom 0.305: v10.92,33.3 10.92,33.81 11.18,34.06 U$14.P$1
N$7  (via drill 0.3, 0.3 pad 0.51)
  Top 0.254: R4.1 v5.31,31.45 | v5.59,28.47 5.8,28.48 U$11.1
  Bottom 0.254: 4.34,30.56 4.34,29.23 5.11,28.47 v5.59,28.47
  Bottom 0.305: 4.93,31.14 4.34,30.56 | U$12.P$1 4.93,31.14 | 4.93,31.14 v5.31,31.45
N$9
  Top 0.152: U3.6 5.97,6.22
  Top 0.33: C1.1 5.97,6.22
N$10
  Top 0.152: U3.2 5.48,5.28
  Top 0.305: 5.48,5.28 5.47,5.26
  Top 0.33: C14.2 5.18,4.95 5.47,5.26
N$11
  Top 0.152: U3.4 6.45,5.26
  Top 0.33: C17.2 6.45,5.26
N$17
  cutout $GND: 11.42,32.7 arc-90 12.11,33.39 12.12,33.39 arc-91 12.8,32.7 arc-88 12.11,32.01 arc-92
N$18
  cutout $+3V3: 7.52,32.7 arc-90 8.21,33.39 8.22,33.39 arc-91 8.9,32.7 arc-88 8.21,32.01 arc-92
N$19
  cutout $+3V3: 11.42,32.7 arc-90 12.11,33.39 12.12,33.39 arc-91 12.8,32.7 arc-88 12.11,32.01 arc-92
N$20
  cutout Bottom: 7.52,32.7 arc-90 8.21,33.39 8.22,33.39 arc-91 8.9,32.7 arc-88 8.21,32.01 arc-92
N$21
  cutout Bottom: 11.42,32.7 arc-90 12.11,33.39 12.12,33.39 arc-91 12.8,32.7 arc-88 12.11,32.01 arc-92
N$22
  cutout $+3V3: 6.77,34.23 6.77,35.38 arc-90 7.43,35.92 7.44,35.92 arc-90 8,35.36 8,34.26 arc-90 7.47,33.68 arc-90
  cutout $+3V3: 12.32,34.23 12.32,35.36 arc-90 12.88,35.92 12.89,35.92 arc-90 13.55,35.33 13.55,34.26 arc-90 12.81,33.68 arc-90
N$27  (via drill 0.3)
  Top 0.305: R2.1 15.52,31.45 v15.42,31.62 | LED2.BLUE 10.91,26.58 v10.92,26.95
  Bottom 0.305: v15.42,31.62 15.42,29.54 15.19,29.26 15.19,27.1 14.53,26.44 11.43,26.44 v10.92,26.95
N$29
  Top 0.305: R7.1 15.47,29.46 15.19,28.98 15.19,28.42 14.96,28.19 14.96,24.54 14.2,23.77 11.76,23.77 11.58,23.95 11.07,23.95 10.91,24.12 LED2.GREEN
N$54  (via drill 0.3)
  Top 0.305: R1.1 4.27,22.99 v3.86,23.29 | v8.31,23.7 8.43,23.82 9.09,23.82 9.41,24.14 LED2.RED
  Bottom 0.305: v3.86,23.29 8,23.29 v8.31,23.7
RF_SW_CTRL0_ANT0  (via drill 0.3)
  Top 0.152: U3.1 5.18,5.87 5.05,5.94
  Top 0.305: v7.34,9.88 6.97,10.25 U1.13
  Top 0.33: v4.55,7.26 C2.1 4.75,6.33 5.05,5.94
  Bottom 0.305: v4.55,7.26 4.75,7.47 4.75,9.17 5.46,9.88 v7.34,9.88
RF_SW_CTRL3_ANT1  (via drill 0.3)
  Top 0.152: U3.5 6.83,5.87 6.88,5.97
  Top 0.254: 7.26,6.28 v7.29,6.5
  Top 0.305: v6.55,11.38 6.12,10.95 U1.12 | C3.1 7.62,6.17 v7.29,6.5
  Top 0.33: 6.88,5.97 7.26,6.45 v7.29,6.5
  $+3V3 0.305: v7.29,6.5 7.62,6.83 7.62,8.94 8.1,9.42 8.1,10.24 6.96,11.38 v6.55,11.38
RGB_BLUE  (via drill 0.3)
  Top 0.305: U1.6 5.88,15.15 6.27,15.24 v6.38,15.27 | v16.48,31.62 R2.2
  $+3V3 0.305: v11.4,13.01 12.42,13.97 12.42,15.34 12.57,15.75 12.57,16.99 11.86,17.7 11.86,19.02 13.59,20.75 13.59,21.06 16.1,23.57 16.1,26.72 17.53,28.14 17.53,30.99 16.89,31.62 v16.48,31.62
  Bottom 0.254: U$6.P$1 16.51,31.65 v16.48,31.62
  Bottom 0.305: v6.38,15.27 7.98,15.27 9.35,13.89 10.26,13.89 11.15,13.01 v11.4,13.01
RGB_GREEN  (via drill 0.3)
  Top 0.305: U1.7 5.74,14.45 v6.5,14.32 | v15.93,28.78 16.48,29.34 R7.2 U$7.P$1
  $+3V3 0.305: v10.13,12.88 11.79,14.58 11.79,15.44 11.96,15.88 11.96,16.82 11.3,17.48 11.3,19.36 12.98,21.03 12.98,21.36 15.44,23.82 15.44,27.08 15.93,27.56 v15.93,28.78
  Bottom 0.305: v6.5,14.32 7.07,14.32 7.72,13.79 8.43,13.79 9.35,12.88 v10.13,12.88 | U$7.P$1 16.51,29.36 v15.93,28.78
RGB_RED  (via drill 0.3)
  Top 0.305: U1.8 5.86,13.75 v6.5,13.36 | v2.67,18.57 2.79,18.69 2.79,19.89 3.38,20.47 3.89,20.47 4.27,20.85 R1.2
  Bottom 0.305: v6.5,13.36 6.27,13.59 5.89,13.95 5.37,14.46 | 5.37,14.46 3.91,15.93 2.79,17.02 2.79,18.44 v2.67,18.57 | U$5.P$1 3.82,14.46 5.37,14.46
RX  (via drill 0.3)
  Top 0.305: v13.97,16.43 14.08,16.55 U1.38
  Bottom 0.305: JP1.9 1.91,24.18 3.5,22.58 7.75,22.58 8.18,22.17 9.8,22.17 10.19,21.79 10.19,19.56 9.73,19.1 9.73,17.65 10.08,17.3 12.52,17.3 13.39,16.43 v13.97,16.43
TX  (via drill 0.3)
  Top 0.305: v10.54,18.06 11.2,18.06 11.79,17.48 14.05,17.48 14.15,17.37 14.28,17.25 U1.39
  Bottom 0.305: JP1.10 2.67,25.78 4.8,25.78 5.87,24.71 8.41,24.71 10.77,22.38 10.77,19.02 10.54,18.82 v10.54,18.06
UFL_ANT
  Top 0.33: C14.1 X2.1
UVCC  (via drill 0.38)
  Top 0.254: 11.53,31.55 11.53,32.05 X1.VBUS
  Top 0.508: 11.63,31.45 11.53,31.55
  Top 0.61: D1.ANODE v5.69,34.65 | v12.01,31.45 11.63,31.45
  Bottom 0.61: v5.69,34.65 5.69,33.86 8.1,31.45 v12.01,31.45
VBAT  (via drill 0.3)
  Top 0.254: U1.28 15.23,9.55 16.05,9.55
  Top 0.305: 16.06,9.55 16.51,9.14 16.51,7.87 16.74,7.64 16.76,7.62 C16.1 15.7,7.09 C15.1 | 16.06,9.55 U1.28 | v16.66,16.48 16.36,16.1 16.36,9.85 16.06,9.55
  Bottom 0.305: JP2.3 17.53,25.65 17.53,22.07 16.76,21.08 16.76,19.15 15.95,18.36 15.95,17.07 16.54,16.48 v16.66,16.48
VIN
  Top 0.254: D1.CATHODE 2.82,32.94 | 2.82,32.94 3.07,32.69 C4.1 3.72,32.22 R4.2 4.04,30.38 U$11.4 | 2.82,32.94 2.82,32.54 2.54,32.26 JP1.12
  pour Top (isolate 0.254, no thermals): 0,31.78 0,35.18 0.89,35.81 4.14,35.81 4.14,32.92 4.11,32.23 4.11,31.17 4.22,31.06 4.67,30.58 3.51,30.48 3.38,30.61 2.77,31.24 2.64,31.37 1.22,31.37
WKP  (via drill 0.3)
  Top 0.305: U1.27 14.36,9.19 14.17,9.4 14.17,9.55 v14.07,9.88 | v13.97,11.94 13.97,14.78 v13.77,14.99
  Bottom 0.305: v14.07,9.88 14.07,11.84 v13.97,11.94 | v13.77,14.99 11.71,14.99 10.39,16.28 9.96,16.28 9.17,17.04 9.17,19.81 7.09,21.89 3.2,21.89 3,22.1 JP1.8

### Text on the board
tDocu: NOTES: / / Layer stack up: / 1 - GTL - Top Copper / 2 - G2L - Inner Ground / 15 - G15L - Inner +3.3V / 16 - GBL - Bottom Copper